# EasyEDA Pro project L298N Motor Driver.eprj

# Schematic Schematic1
Board Name: Board1; Create Date: 2025-09-19; Page Name: P1; Project Name: L298N Motor Driver; Schematic Name: Schematic1; Update Date: 2025-09-19; Company: EasyEDA.com; Page Size: A4; Version: V1.0
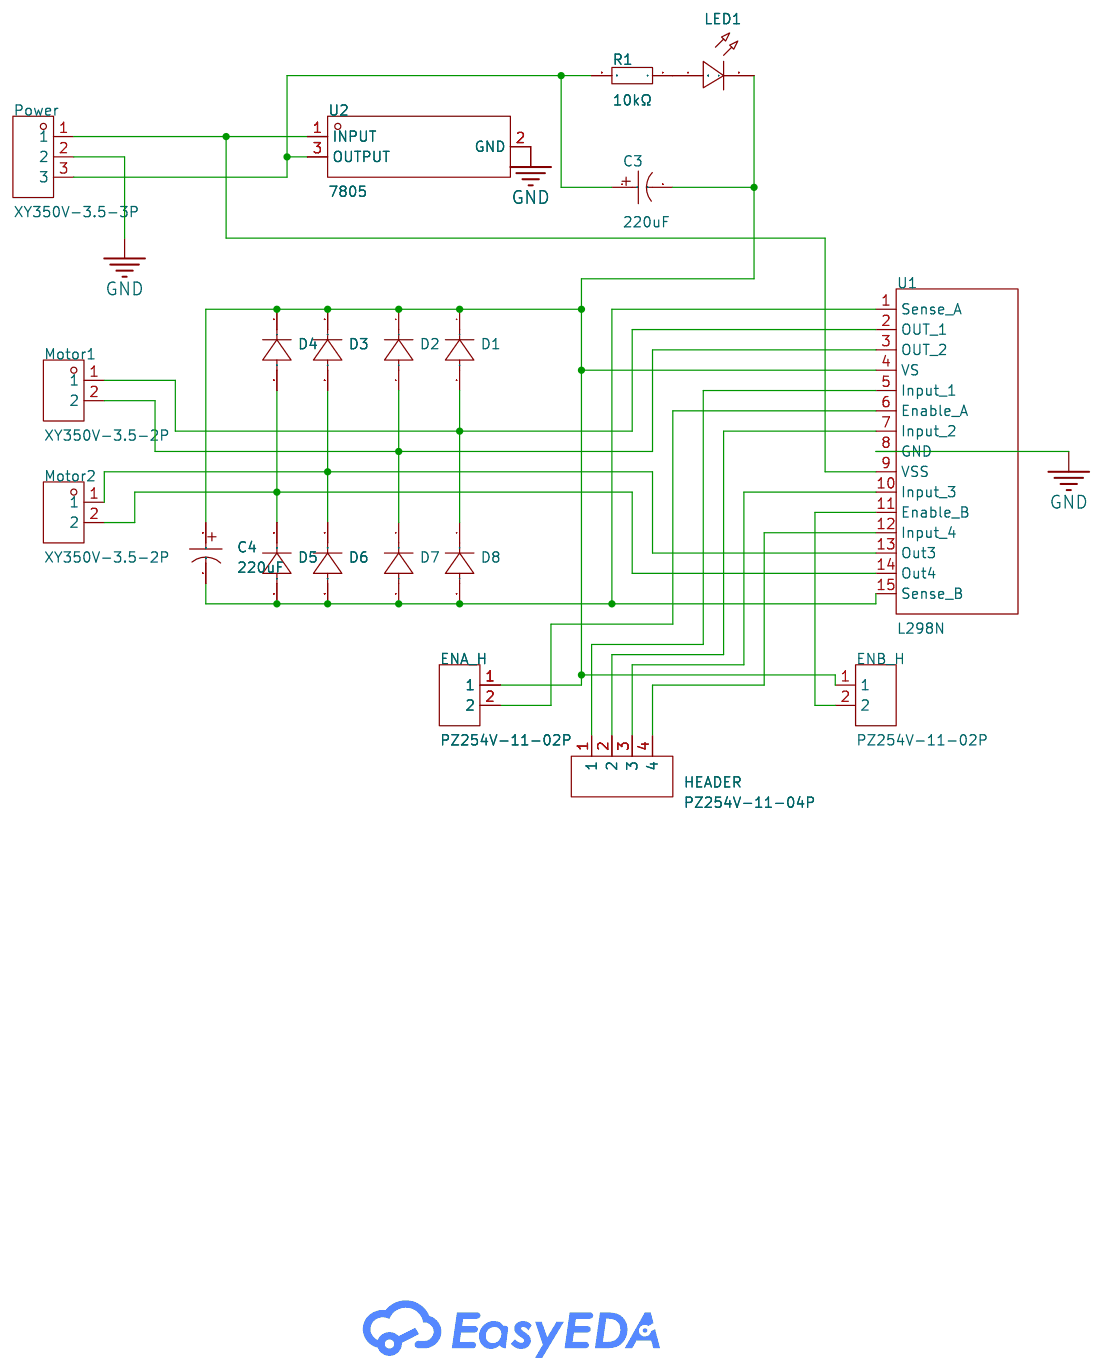
[diagram p0: schematic sheet]

## Parts
C3  220uF  [CAP-SMD_BD8.0-L8.3-W8.3-FD]
C4  220uF  [CAP-SMD_BD8.0-L8.3-W8.3-FD]
D1  -  [DO-41_BD2.4-L4.7-P8.70-D0.9-RD]
D2  -  [DO-41_BD2.4-L4.7-P8.70-D0.9-RD]
D3  -  [DO-41_BD2.4-L4.7-P8.70-D0.9-RD]
D4  -  [DO-41_BD2.4-L4.7-P8.70-D0.9-RD]
D5  -  [DO-41_BD2.4-L4.7-P8.70-D0.9-RD]
D6  -  [DO-41_BD2.4-L4.7-P8.70-D0.9-RD]
D7  -  [DO-41_BD2.4-L4.7-P8.70-D0.9-RD]
D8  -  [DO-41_BD2.4-L4.7-P8.70-D0.9-RD]
ENA_H  PZ254V-11-02P  [HDR-TH_2P-P2.54-V-M]
ENB_H  PZ254V-11-02P  [HDR-TH_2P-P2.54-V-M]
HEADER  PZ254V-11-04P  [HDR-TH_4P-P2.54-V-M]
LED1  -  [LED-TH_BD3.0-P2.54-FD]
Motor1  XY350V-3.5-2P  [CONN-TH_XY350V-3.5-2P]
Motor2  XY350V-3.5-2P  [CONN-TH_XY350V-3.5-2P]
Power  XY350V-3.5-3P  [CONN-TH_XY350V-3.5-3P]
R1  10kΩ  [RES-TH_BD1.8-L3.2-P7.20-D0.4]
U1  L298N  [MULTIWATT-15_L19.6-W5.0-P1.27-L]
U2  7805  [TO-252-2_L6.6-W6.1-P4.57-LS9.9-BR-CW]

## Library data of the parts
C3 C4 = RVT1E221M0810_C82007: LCSC Part Name: 220uF ±20% 25V; Supplier Part: C82007; Manufacturer: Chengx(承兴); Manufacturer Part: RVT1E221M0810; Supplier Footprint: SMD,D8xL10.2mm; JLCPCB Part Class: Extended Part; Datasheet: https://item.szlcsc.com/datasheet/RVT1E221M0810/83162.html; Supplier: LCSC; Tolerance: ±20%; Voltage Rating: 25V; Diameter: 8mm; Height - Seated (Max): 10.2mm; Lifetime: 2000hrs@105℃; Operating Temperature: -45℃~+105℃
D1-D8 = 1N4007: Supplier Footprint: DO-41
ENA_H ENB_H = PZ254V-11-02P: LCSC Part Name: 1x2P 间距:2.54mm 方针 直插; Supplier Part: C492401; Manufacturer: XFCN(兴飞); Supplier Footprint: 插件,P=2.54mm; JLCPCB Part Class: Extended Part; Datasheet: https://item.szlcsc.com/datasheet/PZ254V-11-02P/502957.html; Supplier: LCSC; Pin Structure: 1x2P; Pitch: 2.54mm; Circluar Pins/Square Pins: Pin Header; Mounting Type: Through Hole; Number of Rows: 1; Number of Pins: 2P; Length of Mating Pin: 6mm; Insulation Height: 2.5mm; Length of End Connection Pin: 3mm; Contact Material: Brass; Operating Temperature: -40℃~+105℃; Color: Black
HEADER = PZ254V-11-04P_C492403: LCSC Part Name: 1x4P 间距:2.54mm 方针 直插; Supplier Part: C492403; Manufacturer: XFCN(兴飞); Supplier Footprint: 插件,P=2.54mm; JLCPCB Part Class: Extended Part; Datasheet: https://atta.szlcsc.com/upload/public/pdf/source/20200309/C492403_F9F19131791D08044AD4F84F8E751A34.pdf; Supplier: LCSC; Pin Structure: 1x4P; Pitch: 2.54mm; Circluar Pins/Square Pins: Policy; Mounting Type: Straight; Number of Rows: Single Row; Number of Pins: 4P; Length of Mating Pin: 6mm; Insulation Height: 2.5mm; Length of End Connection Pin: 3mm; Contact Material: Brass; Operating Temperature: -40℃~+105℃; Color: Black
LED1 = LED_TH-R_3mm: Supplier Footprint: Through
Motor1 Motor2 = XY350V-3.5-2P: LCSC Part Name: 1x2P 3.5mm 直插 排数:1 每排P数:2; Supplier Part: C784942; Manufacturer: XINLAIYA(新莱亚); Supplier Footprint: 插件,P=3.5mm; JLCPCB Part Class: Extended Part; Datasheet: https://atta.szlcsc.com/upload/public/pdf/source/20200527/C557655_DACD9A2B7E89CB0723CF2F58FC34C45E.pdf; Supplier: LCSC; Structure: 1x2P; Pitch: 3.5mm; Color: Green; Mounting Style: Straight; Current Rating (Max): 7A; Voltage Rating (Max): 300V; Number of Pins: 2P; Number of Rows: 1; Wire Gauge - AWG: 18~24; Wire Gauge - mm2: 1; Number of PINs Per Row: 2; Contact Material: Copper; Contact Plating: Tin; Screw Specification: M2
Power = XY350V-3.5-3P: LCSC Part Name: 1x3P 3.5mm 直插 排数:1 每排P数:3; Supplier Part: C557655; Manufacturer: XINLAIYA(新莱亚); Supplier Footprint: 插件,P=3.5mm; JLCPCB Part Class: Extended Part; Datasheet: https://item.szlcsc.com/datasheet/XY350V-3.5-3P/581018.html; Supplier: LCSC; Number of Positions or Pins: 1x3P; Pitch: 3.5mm; Color: Green; Mounting Type: Through Hole; Number of Pins: 3P; Number of Rows: 1; Number of PINs Per Row: 3; Screw Specification: M2; Current Rating: 7A; Voltage Rating (Max): 300V; Wire Gauge - AWG: 18~24; Wire Gauge - mm2: 1
R1 = Res_AXIAL-1/8W: Supplier Footprint: Through
U1 = L298N_C434589: Supplier Part: C434589; Manufacturer: HGSEMI(华冠); Supplier Footprint: Multiwatt-15; JLCPCB Part Class: Extended Part; Datasheet: https://atta.szlcsc.com/upload/public/pdf/source/20191028/C434589_04EFAA969F8E2363A048528D2A496B2F.pdf; Supplier: LCSC; Operating Temperature: -25℃~+130℃
U2 = 7805_C19626525: Supplier Part: C19626525; Manufacturer: YFW(佑风微); Supplier Footprint: TO-252; JLCPCB Part Class: Extended Part; Datasheet: https://item.szlcsc.com/datasheet/7805/20915180.html; Supplier: LCSC; Output Type: Fixed; Voltage - Supply: 20V; Output Voltage: 4.75V~5.25V; Output Current: 1.5A; Power Supply Rejection Ratio (PSRR): 73dB@(120Hz); Voltage Dropout: 2V@(1A); standby current: 8mA; Features: Short Circuit Protection；Over Temperature Protection; Operating Temperature: 0℃~+125℃; Output Configuration: Positive; Number of Outputs: 1

## Nets
GND: Power.2 U1.8(GND) U2.2(GND)
Net-(C3-1): C3.1 Power.3 R1.2 U2.3(OUTPUT)
Net-(C3-2): C3.2 C4.1 D1.1(K) D2.1(K) D3.1(K) D4.1(K) ENA_H.1 ENB_H.1 LED1.2(A) U1.4(VS)
Net-(C4-2): C4.2 D5.2(A) D6.2(A) D7.2(A) D8.2(A) U1.1(Sense A) U1.15(Sense B)
Net-(D1-2): D1.2(A) D8.1(K) Motor1.1 U1.2(OUT 1)
Net-(D2-2): D2.2(A) D7.1(K) Motor1.2 U1.3(OUT 2)
Net-(D3-2): D3.2(A) D6.1(K) Motor2.1 U1.13(Out3)
Net-(D4-2): D4.2(A) D5.1(K) Motor2.2 U1.14(Out4)
Net-(ENA_H-2): ENA_H.2 U1.6(Enable A)
Net-(ENB_H-2): ENB_H.2 U1.11(Enable B)
Net-(HEADER-1): HEADER.1 U1.5(Input 1)
Net-(HEADER-2): HEADER.2 U1.7(Input 2)
Net-(HEADER-3): HEADER.3 U1.10(Input 3)
Net-(HEADER-4): HEADER.4 U1.12(Input 4)
Net-(LED1-1): LED1.1(C) R1.1
Net-(Power-1): Power.1 U1.9(VSS) U2.1(INPUT)

# Board PCB1
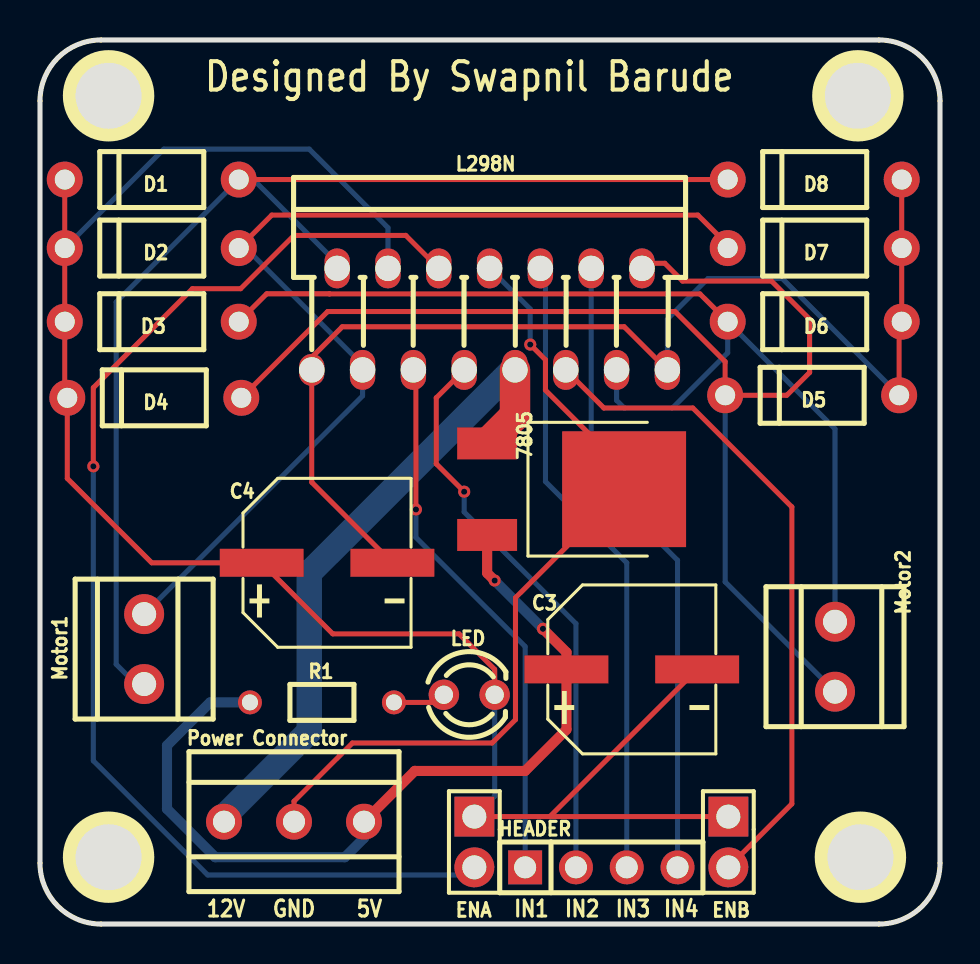
[diagram p1: board, top side]
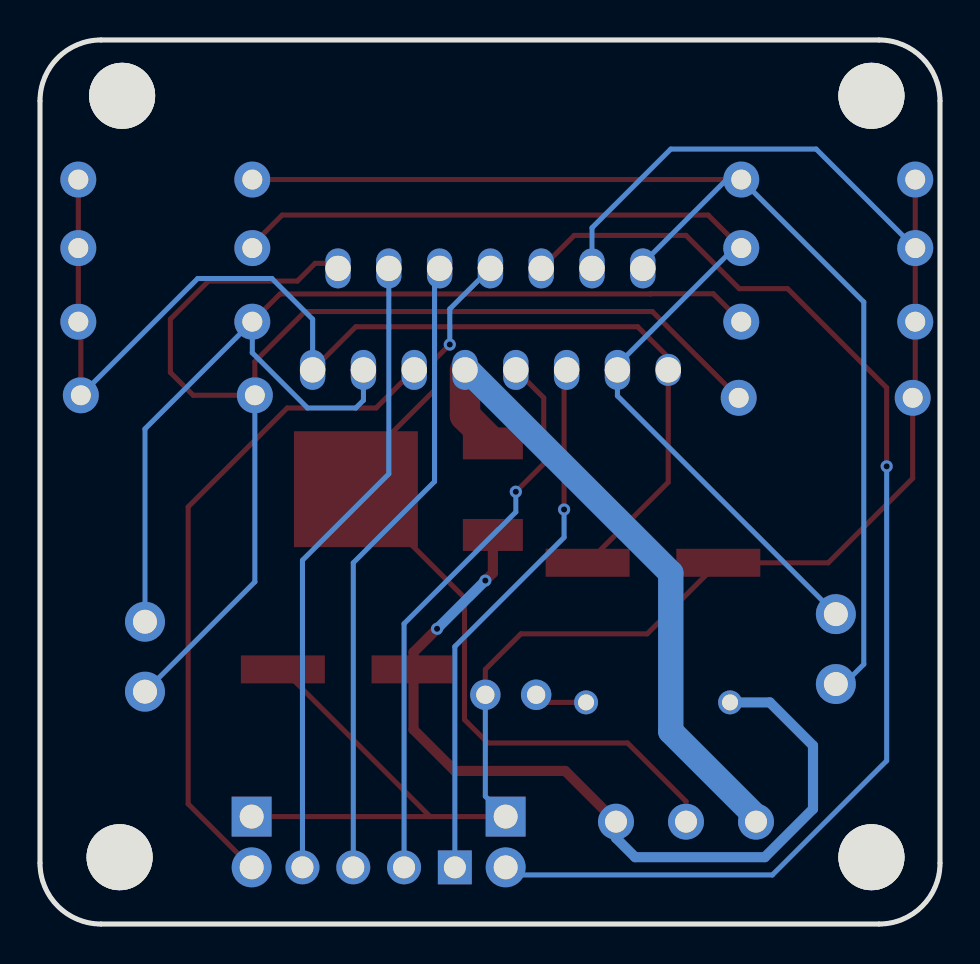
[diagram p2: board, bottom side, seen from below]

Outline 45 x 44.24 mm; copper layers: Top Layer, Bottom Layer. Coordinates in mm from the lower left corner of the outline.
Outline path: 0,41.19 0,3.05 arc(0.89,0.89) 3.05,0 41.95,0 arc(44.11,0.89) 45,3.05 45,41.19 arc(44.11,43.35) 41.95,44.24 3.05,44.24 arc(0.89,43.35) 0,41.19
Stack: Top Layer 0.035mm / Dielectric1 1.51mm FR4 er 4.5 / Bottom Layer 0.035mm

## Design rules (mm)
template: JLCPCB Capability(Two Layers Board)
spacing copperThickness1oz (default): track to track 0.102, other pairs 0.152 to 0.3
spacing copperThickness2oz: track to track 0.203, other pairs 0.152 to 0.3
track width copperThickness1oz (default): min 0.127, default 0.254, max 2.54
track width copperThickness2oz: min 0.203, default 0.254, max 2.54
differential pair differentialPair (default): width min 0.127, default 0.254, max 2.54; gap min 0.152, default 0.152
via viaSize (default): diameter min 0.5, default 0.61, max 10; hole min 0.3, default 0.305, max 6.3

## Placement (name value [footprint] x y rotation side)
7805  7805  [TO-252-2_L6.6-W6.1-P4.57-LS9.9-BR-CW]  25.78 21.76 180 top
C3  220uF  [CAP-SMD_BD8.0-L8.3-W8.3-FD]  29.59 12.74 0 top
C4  220uF  [CAP-SMD_BD8.0-L8.3-W8.3-FD]  14.35 18.08 0 top
D1  -  [DO-41_BD2.4-L4.7-P8.70-D0.9-RD]  5.59 37.25 0 top
D2  -  [DO-41_BD2.4-L4.7-P8.70-D0.9-RD]  5.59 33.82 0 top
D3  -  [DO-41_BD2.4-L4.7-P8.70-D0.9-RD]  5.59 30.14 0 top
D4  -  [DO-41_BD2.4-L4.7-P8.70-D0.9-RD]  5.71 26.33 0 top
D5  -  [DO-41_BD2.4-L4.7-P8.70-D0.9-RD]  38.61 26.46 0 top
D6  -  [DO-41_BD2.4-L4.7-P8.70-D0.9-RD]  38.73 30.14 0 top
D7  -  [DO-41_BD2.4-L4.7-P8.70-D0.9-RD]  38.73 33.82 0 top
D8  -  [DO-41_BD2.4-L4.7-P8.70-D0.9-RD]  38.73 37.25 0 top
ENA  PZ254V-11-02P  [HDR-TH_2P-P2.54-V-M]  21.72 4.11 270 top
ENB  PZ254V-11-02P  [HDR-TH_2P-P2.54-V-M]  34.42 4.11 270 top
HEADER  PZ254V-11-04P  [HDR-TH_4P-P2.54-V-M]  28.07 2.84 0 top
L298N  L298N  [MULTIWATT-15_L19.6-W5.0-P1.27-L]  22.48 30.27 0 top
LED  -  [LED-TH_BD3.0-P2.54-FD]  21.46 11.47 0 top
Motor1  XY350V-3.5-2P  [CONN-TH_XY350V-3.5-2P]  5.21 13.76 90 top
Motor2  XY350V-3.5-2P  [CONN-TH_XY350V-3.5-2P]  39.75 13.38 270 top
NOREF  -  [Pad_e23]  40.89 41.44 0 top
NOREF#2  -  [Pad_e20]  3.43 41.44 0 top
NOREF#3  -  [Pad_e25]  41.02 3.34 0 top
NOREF#4  -  [Pad_e24]  3.43 3.34 0 top
Power Connector  XY350V-3.5-3P  [CONN-TH_XY350V-3.5-3P]  12.7 5.12 0 top
R1  10kΩ  [RES-TH_BD1.8-L3.2-P7.20-D0.4]  14.1 11.09 180 top

## Footprints (pads in the part's own frame, mm; a bottom-side part is the same pattern mirrored in y, then rotated)
CAP-SMD_BD8.0-L8.3-W8.3-FD
  rect 4.2x1.4 smd: 1(-3.267,0) 2(3.267,0)
CONN-TH_XY350V-3.5-2P
  round 2 hole 1.2: 1(-1.75,0) 2(1.75,0)
CONN-TH_XY350V-3.5-3P
  round 1.8 hole 1.1: 1(-3.5,0) 2(0,0) 3(3.5,0)
DO-41_BD2.4-L4.7-P8.70-D0.9-RD
  round 1.8 hole 1: 1(-4.35,0) 2(4.35,0)
HDR-TH_2P-P2.54-V-M
  rect 2x2 hole 1.2: 1(-1.27,0)
  round 2 hole 1.2: 2(1.27,0)
HDR-TH_4P-P2.54-V-M
  rect 1.7x1.7 hole 1.1: 1(-3.81,0)
  round 1.7 hole 1.1: 2(-1.27,0) 3(1.27,0) 4(3.81,0)
LED-TH_BD3.0-P2.54-FD
  round 1.524 hole 0.914: 1(-1.27,0) 2(1.27,0)
MULTIWATT-15_L19.6-W5.0-P1.27-L
  oval 1.27x1.6 hole 1.3x1.143: 1(-8.89,-2.54)
  oval 1.27x2 hole 1.3x1.143: 2(-7.62,2.54) 3(-6.35,-2.54) 4(-5.08,2.54) 5(-3.81,-2.54) 6(-2.54,2.54) 7(-1.27,-2.54) 8(0,2.54) 9(1.27,-2.54) 10(2.54,2.54) 11(3.81,-2.54) 12(5.08,2.54) 13(6.35,-2.54) 14(7.62,2.54) 15(8.89,-2.54)
Pad_e20
  round 3.302 hole 3.302: 1(0,0)
Pad_e23
  round 3.302 hole 3.302: 1(0,0)
Pad_e24
  round 3.302 hole 3.302: 1(0,0)
Pad_e25
  round 3.302 hole 3.302: 1(0,0)
RES-TH_BD1.8-L3.2-P7.20-D0.4
  round 1.2 hole 0.8: 1(-3.6,0) 2(3.6,0)
TO-252-2_L6.6-W6.1-P4.57-LS9.9-BR-CW
  rect 3x1.6 smd: 1(3.424,-2.29) 3(3.424,2.29)
  rect 6.2x5.8 smd: 2(-3.424,0)

## Nets
GND: 7805.2 L298N.8 Power Connector.2
$1N1310: 7805.1 L298N.9 Power Connector.1
$1N1440: C3.2 C4.1 D1.1 D2.1 D3.1 D4.1 ENA.1 ENB.1 L298N.4 LED.2
$1N1446: 7805.3 C3.1 Power Connector.3 R1.2
$1N1448: LED.1 R1.1
$1N1508: D4.2 D5.1 L298N.14 Motor2.2
$1N1512: D3.2 D6.1 L298N.13 Motor2.1
$1N1525: D2.2 D7.1 L298N.3 Motor1.2
$1N1573: C4.2 D5.2 D6.2 D7.2 D8.2 L298N.1 L298N.15
$1N1779: D1.2 D8.1 L298N.2 Motor1.1
$1N2092: ENA.2 L298N.6
$1N2099: ENB.2 L298N.11
$1N2118: HEADER.1 L298N.5
$1N2128: HEADER.2 L298N.7
$1N2164: HEADER.3 L298N.10
$1N2174: HEADER.4 L298N.12

Pads without a net: NOREF 1; NOREF#2 1; NOREF#3 1; NOREF#4 1

## Via types
v1: diameter 0.61, hole 0.305, Top Layer to Bottom Layer, 6 vias

## Routing (per net, layer and track width the routed paths; a pad name or vN(x,y) marks a point on that pad's centre or on a via; arc(x,y) is an arc through that point)
GND: length 41.4
  Top Layer w0.254: v1(24.51,29) 25.27,28.24 25.27,26.71 29.2,22.78 7805.2 23.77,16.33 23.77,10.23 22.61,9.06 15.62,9.06 12.7,6.14 Power Connector.2
  Bottom Layer w0.254: v1(24.51,29) 24.51,30.78 L298N.8
$1N1310: length 33.1
  Top Layer w1.524: 7805.1 23.75,25.44 L298N.9
  Bottom Layer w1.27: Power Connector.1 9.2,5.38 13.46,9.64 13.46,17.57 23.75,27.86 23.75,27.98
$1N1440: length 92.9
  Top Layer w0.254: 25.49,5.38 ENA.1 ; 25.49,5.38 C3.2 ; 25.49,5.38 ENB.1 ; LED.2 22.73,12.74 20.95,14.52 14.64,14.52 C4.1 5.59,18.08 1.36,22.3 D4.1 1.24,26.46 D3.1 D2.1 D1.1
  Bottom Layer w0.254: ENA.1 22.73,6.39 LED.2 ; 17.4,33.06 17.4,34.84 13.46,38.78 6.19,38.78 D2.1
$1N1446: length 43.7
  Top Layer w0.508: 7805.3 22.36,17.56 v1(22.73,17.19) ; v1(25.15,14.77) 26.32,13.6 C3.1 26.32,9.73 24.26,7.66 18.74,7.66 Power Connector.3
  Bottom Layer w0.508: Power Connector.3 16.2,4.3 15.24,3.34 8.76,3.34 6.35,5.76 6.35,8.93 8.51,11.09 R1.2 ; v1(22.73,17.19) v1(25.15,14.77)
$1N1448: length 2.7
  Top Layer w0.254: LED.1 19.81,11.09 R1.1
$1N1508: length 62.7
  Top Layer w0.254: 30.1,33.06 31.24,33.06 32.13,32.17 36.58,32.17 38.48,30.27 38.48,27.6 37.34,26.46 34.26,26.46 34.26,28.14 31.75,30.65 14.38,30.65 D4.2
  Bottom Layer w0.254: Motor2.2 34.26,17.12 34.26,26.46
$1N1512: length 52.8
  Top Layer w0.254: D3.2 11.34,31.54 14.47,31.54 14.48,31.53 33,31.53 D6.1
  Bottom Layer w0.254: Motor2.1 39.75,24.78 D6.1 34.38,28.58 31.62,25.82 29.21,25.82 28.83,26.2 L298N.13
$1N1525: length 51.5
  Top Layer w0.254: D2.2 11.59,35.47 32.89,35.47 34.38,33.98 D7.1
  Bottom Layer w0.254: Motor1.2 16.13,26.43 16.13,27.98 10.29,33.82 D2.2
$1N1573: length 59.5
  Top Layer w0.254: D8.2 D7.2 D6.2 42.96,30.01 D5.2 ; C4.2 13.59,22.11 L298N.1 13.59,28.36 15.11,29.89 29.21,29.89 L298N.15
  Bottom Layer w0.254: D5.2 37.12,32.3 33.4,32.3 31.37,30.27 L298N.15
$1N1779: length 59.7
  Top Layer w0.254: D1.2 D8.1
  Bottom Layer w0.254: 14.86,33.06 10.67,37.25 D1.2 3.81,31.12 3.81,13 4.8,12.01 Motor1.1
$1N2092: length 61.2
  Top Layer w0.254: 2.67,23.03 2.67,26.84 7.62,31.79 10.03,31.79 12.7,34.46 18.29,34.46 L298N.6
  Bottom Layer w0.254: ENA.2 21.34,2.45 8.38,2.45 2.67,8.17 v1(2.67,22.9)
$1N2099: length 33.5
  Top Layer w0.254: ENB.2 37.59,6.01 37.59,20.87 32.64,25.82 28.19,25.82 L298N.11
$1N2118: length 27.2
  Top Layer w0.254: v1(18.8,20.74) 18.8,27.6 L298N.5
  Bottom Layer w0.254: v1(18.8,20.74) 18.8,19.35 24.26,13.89 HEADER.1
$1N2128: length 28.4
  Top Layer w0.254: L298N.7 19.81,26.33 19.81,23.03 v1(21.21,21.63)
  Bottom Layer w0.254: v1(21.21,21.63) 21.21,20.62 26.8,15.03 HEADER.2
$1N2164: length 31.8
  Bottom Layer w0.254: HEADER.3 29.34,18.08 25.27,22.14 25.27,32.55 L298N.10
$1N2174: length 31.8
  Bottom Layer w0.254: L298N.12 27.56,22.52 31.88,18.2 HEADER.4

## Text on the board
Top Silkscreen Layer: 12V | GND | 5V | IN1 | IN2 | IN3 | IN4 | Designed By Swapnil Barude
